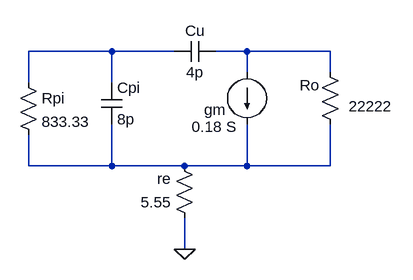
[diagram p0: schematic Draft5.asc]
Draft5.asc, the LTspice schematic file:
Version 4
SHEET 1 880 680
WIRE 384 192 256 192
WIRE 480 192 384 192
WIRE 592 192 544 192
WIRE 720 192 592 192
WIRE 592 224 592 192
WIRE 720 224 720 192
WIRE 256 240 256 192
WIRE 384 240 384 192
WIRE 256 368 256 320
WIRE 384 368 384 304
WIRE 384 368 256 368
WIRE 496 368 384 368
WIRE 592 368 592 304
WIRE 592 368 496 368
WIRE 720 368 720 304
WIRE 720 368 592 368
WIRE 496 496 496 448
FLAG 496 496 0
SYMBOL Res 240 224 R0
SYMATTR InstName Rpi
SYMATTR Value 833.33
SYMBOL Cap 368 240 R0
SYMATTR InstName Cpi
SYMATTR Value 8p
SYMBOL Res 736 320 R180
WINDOW 0 63 76 Right 2
WINDOW 3 -46 44 Center 2
SYMATTR InstName Ro
SYMATTR Value 22222
SYMBOL Res 512 464 R180
WINDOW 0 36 76 Left 2
WINDOW 3 36 40 Left 2
SYMATTR InstName re
SYMATTR Value 5.55
SYMBOL Cap 544 176 R90
WINDOW 0 0 32 VBottom 2
WINDOW 3 32 32 VTop 2
SYMATTR InstName Cu
SYMATTR Value 4p
SYMBOL current 592 224 R0
WINDOW 0 -66 58 Left 2
WINDOW 3 -15 84 Right 2
SYMATTR InstName gm
SYMATTR Value 0.18 S

The netlist it stands for:
* Draft5.asc
Rpi N001 N003 833.33
Cpi N001 N003 8p
Ro N003 N002 22222
re 0 N003 5.55
Cu N002 N001 4p
I§gm N002 N003 0.18 S
.backanno
.end